# EAGLE design zeitgeist (EAGLE 9.6.2)
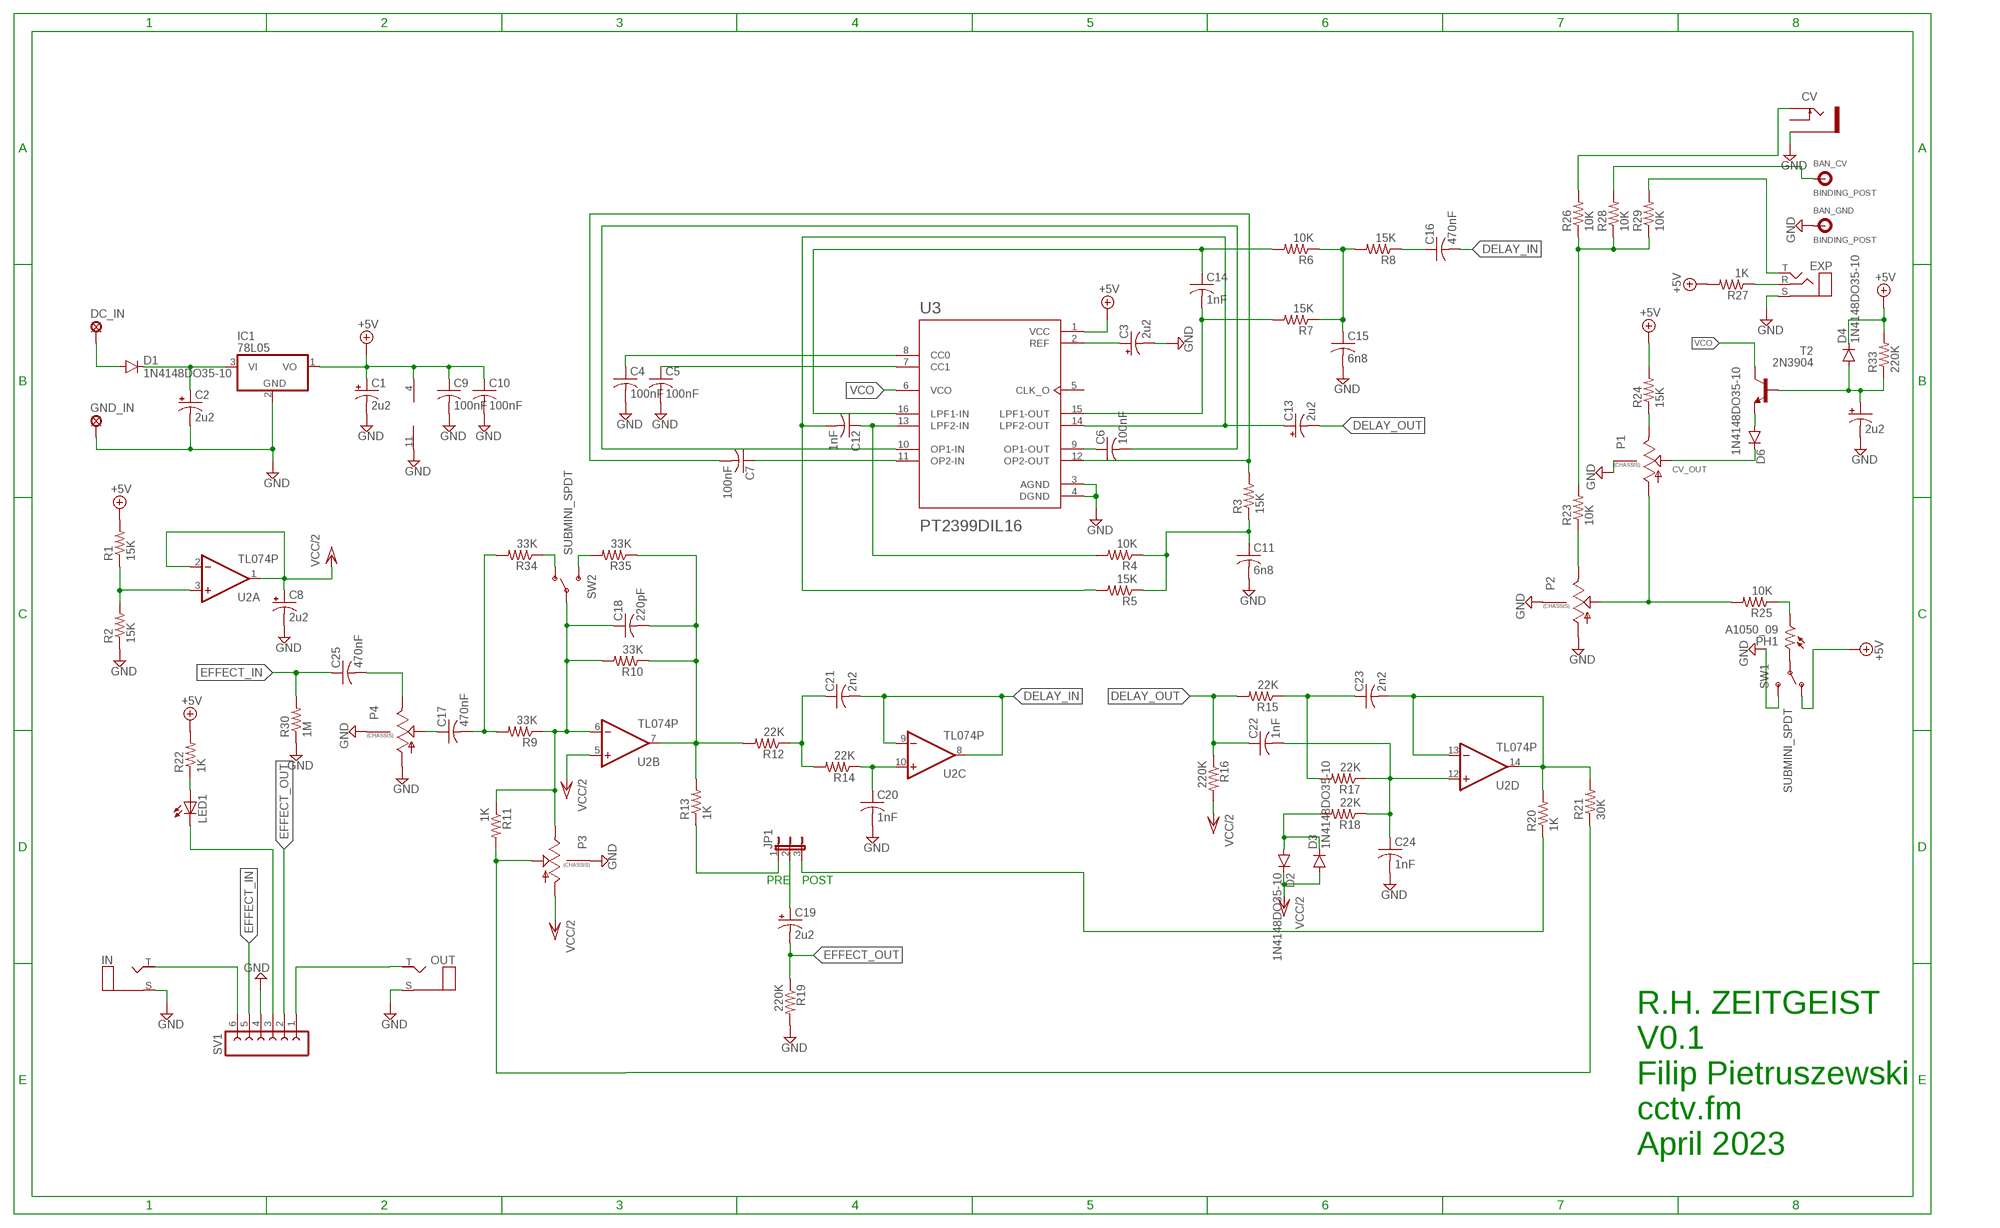
[diagram p0: schematic, sheet 1]

## Parts
BAN_CV  BINDING_POST  [BINDING_POST]
BAN_GND  BINDING_POST  [BINDING_POST]
C1  2u2  CPOL-USE2.5-6  [E2,5-6]
C2  2u2  CPOL-USE2.5-6  [E2,5-6]
C3  2u2  CPOL-USE2.5-6  [E2,5-6]
C4  100nF  C-US050-024X044  [C050-024X044]
C5  100nF  C-US050-024X044  [C050-024X044]
C6  100nF  C-US050-035X075  [C050-035X075]
C7  100nF  C-US050-035X075  [C050-035X075]
C8  2u2  CPOL-USE2.5-6  [E2,5-6]
C9  100nF  C-US050-024X044  [C050-024X044]
C10  100nF  C-US050-024X044  [C050-024X044]
C11  6n8  C-US050-035X075  [C050-035X075]
C12  1nF  C-US050-035X075  [C050-035X075]
C13  2u2  CPOL-USE2.5-6  [E2,5-6]
C14  1nF  C-US050-035X075  [C050-035X075]
C15  6n8  C-US050-035X075  [C050-035X075]
C16  470nF  C-US050-035X075  [C050-035X075]
C17  470nF  C-US050-035X075  [C050-035X075]
C18  220pF  C-US050-035X075  [C050-035X075]
C19  2u2  CPOL-USE2.5-6  [E2,5-6]
C20  1nF  C-US050-035X075  [C050-035X075]
C21  2n2  C-US050-035X075  [C050-035X075]
C22  1nF  C-US050-035X075  [C050-035X075]
C23  2n2  C-US050-035X075  [C050-035X075]
C24  1nF  C-US050-035X075  [C050-035X075]
C25  470nF  C-US050-035X075  [C050-035X075]
C26  2u2  CPOL-USE2.5-6  [E2,5-6]
CV  THONKICONNNEW  [WQP-PJ301M-12_JACK]
D1  1N4148DO35-10  [DO35-10]
D2  1N4148DO35-10  [DO35-10]
D3  1N4148DO35-10  [DO35-10]
D4  1N4148DO35-10  [DO35-10]
D6  1N4148DO35-10  [DO35-10]
DC_IN  SE14  [SE14]
EXP  STEREO_PADS  [3PADS]
GND_IN  SE14  [SE14]
IC1  78L05  78L05Z  [TO92]
IN  MONO_PADS  [2PADS]
JP1  JP2E  [JP2]
LED1  LED5MM  [LED5MM]
OUT  MONO_PADS  [2PADS]
P1  9MM_SNAP-IN_POT_CHASSIS  [9MM_SNAP-IN_POT]
P2  9MM_SNAP-IN_POT_CHASSIS  [9MM_SNAP-IN_POT]
P3  9MM_SNAP-IN_POT_CHASSIS  [9MM_SNAP-IN_POT]
P4  9MM_SNAP-IN_POT_CHASSIS  [9MM_SNAP-IN_POT]
PH1  A1050_09  [T0-46-A10XX]
R1  15K  RES-7.5-EASYSOLDER  [0204/7]
R2  15K  RES-7.5-EASYSOLDER  [0204/7]
R3  15K  RES-7.5-EASYSOLDER  [0204/7]
R4  10K  RES-7.5-EASYSOLDER  [0204/7]
R5  15K  RES-7.5-EASYSOLDER  [0204/7]
R6  10K  RES-7.5-EASYSOLDER  [0204/7]
R7  15K  RES-7.5-EASYSOLDER  [0204/7]
R8  15K  RES-7.5-EASYSOLDER  [0204/7]
R9  33K  RES-7.5-EASYSOLDER  [0204/7]
R10  33K  RES-7.5-EASYSOLDER  [0204/7]
R11  1K  RES-7.5-EASYSOLDER  [0204/7]
R12  22K  RES-7.5-EASYSOLDER  [0204/7]
R13  1K  RES-7.5-EASYSOLDER  [0204/7]
R14  22K  RES-7.5-EASYSOLDER  [0204/7]
R15  22K  RES-7.5-EASYSOLDER  [0204/7]
R16  220K  RES-7.5-EASYSOLDER  [0204/7]
R17  22K  RES-7.5-EASYSOLDER  [0204/7]
R18  22K  RES-7.5-EASYSOLDER  [0204/7]
R19  220K  RES-7.5-EASYSOLDER  [0204/7]
R20  1K  RES-7.5-EASYSOLDER  [0204/7]
R21  30K  RES-7.5-EASYSOLDER  [0204/7]
R22  1K  RES-7.5-EASYSOLDER  [0204/7]
R23  10K  RES-7.5-EASYSOLDER  [0204/7]
R24  15K  RES-7.5-EASYSOLDER  [0204/7]
R25  10K  RES-7.5-EASYSOLDER  [0204/7]
R26  10K  RES-7.5-EASYSOLDER  [0204/7]
R27  1K  RES-7.5-EASYSOLDER  [0204/7]
R28  10K  RES-7.5-EASYSOLDER  [0204/7]
R29  10K  RES-7.5-EASYSOLDER  [0204/7]
R30  1M  RES-7.5-EASYSOLDER  [0204/7]
R33  220K  RES-7.5-EASYSOLDER  [0204/7]
R34  33K  RES-7.5-EASYSOLDER  [0204/7]
R35  33K  RES-7.5-EASYSOLDER  [0204/7]
SV1  FE06-1  [FE06]
SW1  SUBMINI_SPDT  [SUBMINI_TOGGLE]
SW2  SUBMINI_SPDT  [SUBMINI_TOGGLE]
T2  2N3904  [TO92]
U2  TL074P  [DIL14]
U3  PT2399DIL16  [DIL16]

## Nets
+5V: C1.+ C9.1 C10.1 D4.C IC1.1(VO) R1.2 R22.2 R24.2 R27.2 R33.2 SW1.1(O) U2.4(P:V+) U3.1(VCC)
CV_IN: CV.P$1_TIP(TIP) R26.2
CV_OUT: D6.C P1.2(S)
DELAY_IN: C16.2 C21.2 U2.8(C:OUT) U2.9(C:-IN)
DELAY_OUT: C13.- C22.1 R15.2 R16.1
EFFECT_IN: C25.1 R30.2 SV1.5
EFFECT_OUT: C19.- R19.1 SV1.2
GND: BAN_GND.P$1 C1.- C2.- C3.- C4.2 C5.2 C8.- C9.2 C10.2 C11.2 C15.2 C20.2 C24.2 C26.- CV.P$3_SLEEVE(SLEEVE) EXP.S GND_IN.MP IC1.2(GND) IN.S OUT.S P1.CHASSIS1 P1.CHASSIS2 P2.1(A) P2.CHASSIS1 P2.CHASSIS2 P3.CHASSIS1 P3.CHASSIS2 P4.1(A) P4.CHASSIS1 P4.CHASSIS2 R2.1 R19.2 R30.1 SV1.4 SW1.3(S) U2.11(P:V-) U3.3(AGND) U3.4(DGND)
N$1: C2.+ D1.C IC1.3(VI)
N$2: C6.2 U3.10(OP1-IN)
N$3: C6.1 U3.9(OP1-OUT)
N$4: C7.1 U3.11(OP2-IN)
N$5: C3.+ U3.2(REF)
N$6: C7.2 R3.2 U3.12(OP2-OUT)
N$7: R1.1 R2.2 U2.3(A:+IN)
N$8: C5.1 U3.7(CC1)
N$9: C4.1 U3.8(CC0)
N$10: C11.1 R3.1 R4.1 R5.1
N$11: C12.1 R4.2 U3.13(LPF2-IN)
N$12: C23.1 R15.1 R17.2
N$13: C12.2 C13.+ R5.2 U3.14(LPF2-OUT)
N$14: C14.1 R6.2 U3.16(LPF1-IN)
N$15: C14.2 R7.2 U3.15(LPF1-OUT)
N$16: C15.1 R6.1 R7.1 R8.2
N$17: C16.1 R8.1
N$18: D1.A DC_IN.MP
N$19: C17.1 P4.2(S)
N$20: C18.1 P3.3(E) R9.1 R10.2 R11.1 SW2.COM(COMMON) U2.6(B:-IN)
N$21: C17.2 R9.2 R34.2
N$22: P3.2(S) R11.2 R21.1
N$23: C18.2 R10.1 R12.2 R13.2 R35.1 U2.7(B:OUT)
N$24: C19.+ JP1.2
N$25: JP1.1 R13.1
N$26: C21.1 R12.1 R14.2
N$27: C20.1 R14.1 U2.10(C:+IN)
N$28: C22.2 C24.1 R17.1 R18.1 U2.12(D:+IN)
N$29: D2.A D3.C R18.2
N$30: LED1.A R22.1
N$31: C23.2 R20.2 R21.2 U2.13(D:-IN) U2.14(D:OUT)
N$32: P2.3(E) R23.1
N$33: JP1.3 R20.1
N$34: P1.1(A) P2.2(S) R25.2
N$35: P1.3(E) R24.1
N$36: D6.A T2.3(E)
N$37: PH1.2 R25.1
N$38: PH1.1 SW1.COM(COMMON)
N$39: R23.2 R26.1 R28.1 R29.1
N$40: EXP.R R27.1
N$41: LED1.K(C) SV1.3
N$42: C25.2 P4.3(E)
N$43: IN.T SV1.6
N$44: EXP.T R29.2
N$45: BAN_CV.P$1 R28.2
N$46: OUT.T SV1.1
N$47: R35.2 SW2.3(S)
N$48: R34.1 SW2.1(O)
N$52: C26.+ D4.A R33.1 T2.2(B)
VCC/2: C8.+ D2.C D3.A P3.1(A) R16.2 U2.1(A:OUT) U2.2(A:-IN) U2.5(B:+IN)
VCO: T2.1(C) U3.6(VCO)
Unconnected: CV.P$2_SWITCH(SWITCH) U3.5(CLK_O)

## Notes on the sheet
- PRE | POST
- R.H. ZEITGEIST
  V0.1
  Filip Pietruszewski
  cctv.fm
  April 2023

## Library data of the parts
BAN_CV BAN_GND = SparkFun-Connectors:BINDING_POST: Single Banana jack. PRT-09739 (red) or PRT-09740 (blk) Footprint is a bit strange. The component itself has an threaded, insulated body that goes through the board, with a small threaded metal stud coming off the back. The intent of this package is that the post goes through a milled obling hole, and a small wire would be used to connect from the PCB pad to the metal contact on the post.
C1-C3 C8 C13 C19 C26 = rcl:CPOL-US: POLARIZED CAPACITOR, American symbol; SPICEPREFIX: C
C4-C7 C9-C12 C14-C18 C20-C25 = rcl:C-US: CAPACITOR, American symbol; SPICEPREFIX: C
CV = MusicThingModular:THONKICONN: 3.5mm socket for Eurorack modular synths
D1-D4 D6 = diode:1N4148: DIODE high speed (Philips)
DC_IN GND_IN = solpad:SE14: SOLDER PAD E1553, drill 1,4mm, distributor Buerklin, 07F820
EXP = jacks:STEREO: Stereo 1/4" TRS Jack and wiring connections Marshall style (PCB Mount): http://smallbear-electronics.mybigcommerce.com/1-4-enclosed-nmj6hcd2/ Lumberg Stereo (wired): http://smallbear-electronics.mybigcommerce.com/lumberg-1-4-compact-shrouded-stereo-jack/
IC1 = linear:78*: Positive VOLTAGE REGULATOR Source: http://cache.national.com/ds/LM/LM78L05.pdf http://www.fairchildsemi.com/ds/LM/LM7805.pdf
IN OUT = jacks:MONO: Mono 1/4" TS Jack and wiring connections Marshall style (PCB Mount): http://smallbear-electronics.mybigcommerce.com/1-4-enclosed-nmj4hcd2/ Lumberg Mono (wired): http://smallbear-electronics.mybigcommerce.com/lumberg-1-4-compact-shrouded-mono-jack/
JP1 = jumper:JP2E: JUMPER
LED1 = adafruit:LED: LED OSRAM: - CHIPLED LG R971, LG N971, LY N971, LG Q971, LY Q971, LO R971, LY R971 LH N974, LH R974 LS Q976, LO Q976, LY Q976 LO Q996 - Hyper CHIPLED LW Q18S LB Q993, LB Q99A, LB R99A - SideLED LS A670, LO A670, LY A670, LG A670, LP A670 LB A673, LV A673, LT A673, LW A673 LH A674 LY A675 LS A676, LA A676, LO A676, LY A676, LW A676 LS A679, LY A679, LG A679 - Hyper Micro SIDELED® LS Y876, LA Y876, LO Y876, LY Y876 LT Y87S - SmartLED LW L88C, LW L88S LB L89C, LB L89S, LG L890 LS L89K, LO L89K, LY L89K LS L896, LA L896, LO L896, LY L896 - TOPLED LS T670, LO T670, LY T670, LG T670, LP T670 LSG T670, LSP T670, LSY T670, LOP T670, LYG T670 LG T671, LOG T671, LSG T671 LB T673, LV T673, LT T673, LW T673 LH T674 LS T676, LA T676, LO T676, LY T676, LB T676, LH T676, LSB T676, LW T676 LB T67C, LV T67C, LT T67C, LS T67K, LO T67K, LY T67K, LW E67C LS E67B, LA E67B, LO E67B, LY E67B, LB E67C, LV E67C, LT E67C LW T67C LS T679, LY T679, LG T679 LS T770, LO T770, LY T770, LG T770, LP T770 LB T773, LV T773, LT T773, LW T773 LH T774 LS E675, LA E675, LY E675, LS T675 LS T776, LA T776, LO T776, LY T776, LB T776 LHGB T686 LT T68C, LB T68C - Hyper Mini TOPLED® LB M676 - Mini TOPLED Santana® LG M470 LS M47K, LO M47K, LY M47K Source: http://www.osram.convergy.de/
P1-P4 = MusicThingModular:9MM_SNAP-IN_POT_CHASSIS: 9mm vertical snap-in pot, Alpha / Panasonic style, with a connection to the metal chassis for grounding
PH1 = photo-elements:A10: Sensor Robust Light Sensing Applications Outdoor Light Sensing Application Source: http://optoelectronics.perkinelmer.com/content/Datasheets/DTS_PhotocellsA1050.pdf
R1-R30 R33-R35 = ptrz:RES-7.5-EASYSOLDER
SV1 = con-lsta:FE06-1: FEMALE HEADER; OC_FARNELL: unknown; OC_NEWARK: unknown
SW1 SW2 = MusicThingModular:SUBMINI_SPDT
T2 = transistor:2N3904: NPN TRANSISTOR
U2 = linear:TL074: OP AMP
U3 = PT2399:PT2399: Check availability <https://pricing.snapeda.com/parts/PT2399/Princeton/view-part?ref=eda>

## Net classes
0 default: width 0.508 mm, drill 0.508 mm, clearance 0.508 mm

## Board
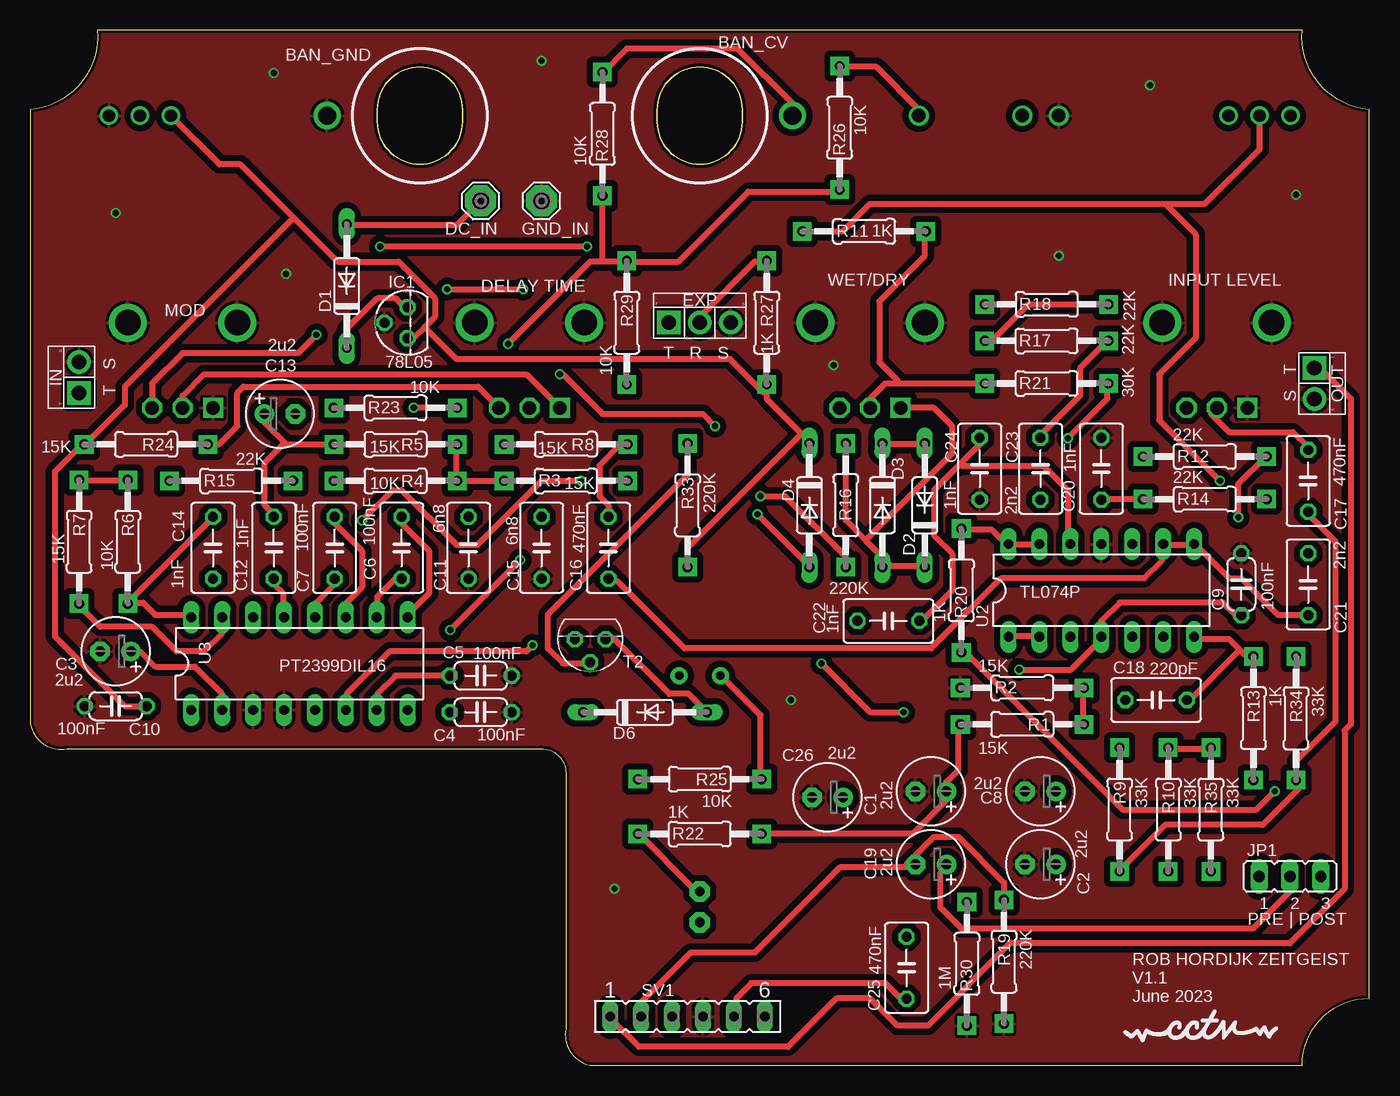
[diagram p1: board, top side]
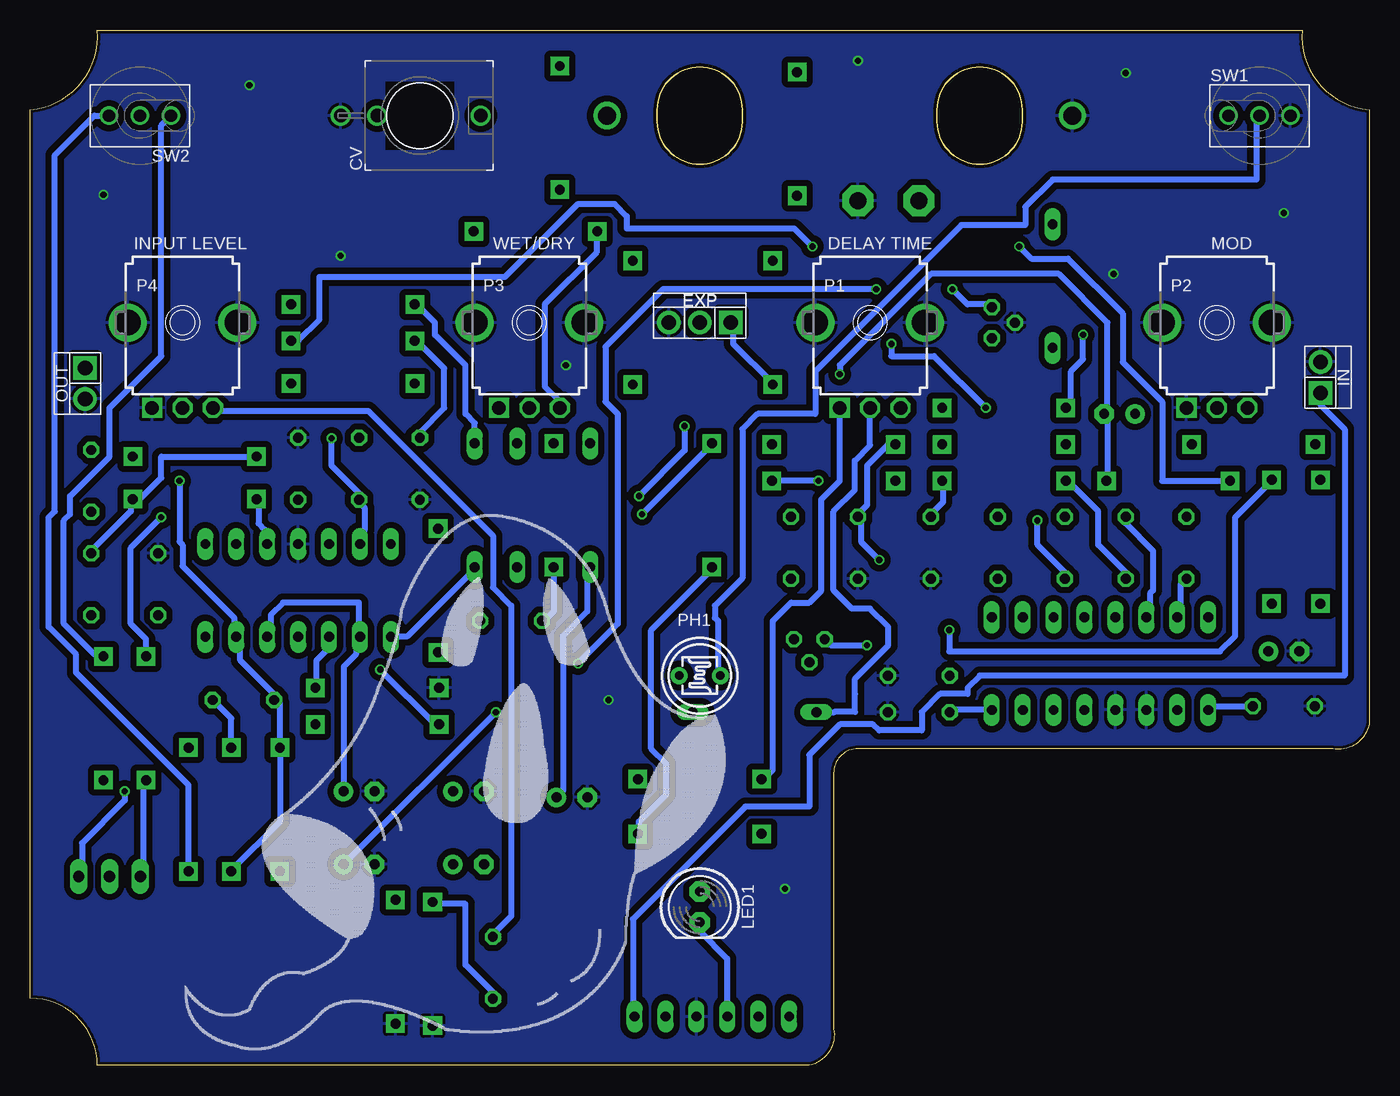
[diagram p2: board, bottom side, seen from below]

Size 110 x 85 mm. Coordinates in mm from the lower left corner, seen from the top.
Outline: 44,24 44,3 arc90 46,0 104.5,0 arc-90 110,5.5 110,78.5 arc-90 104.5,85 5.5,85 arc-90 0,78.5 0,28 arc90 3,26 42,26 arc-90 44,24
Copper layers (1*16): Top 0.035mm / dielectric 1.5mm / Bottom 0.035mm
Design rules "dirt_cheap_dirty_boards.v1": minimum track width 5mil, minimum drill 12mil, track to track 5mil, track to pad 5mil, pad to pad 5mil, via to via 5mil, smd to smd 0mil, copper to edge 10mil, drill to drill 10mil, minimum pad ring 10mil, minimum via ring 6mil, stop-mask expansion 2mil, vias tented up to drill 25mil, thermal gap 10mil

### Footprints (pad centres in the part's own frame; a part is rotated, then mirrored left to right if it is on the bottom)
BINDING_POST = drill 1.5: P$1 0,7.62
E2,5-6 = drill 0.813 pad 1.6: + -1.27,0 | drill 0.813 pad 1.6 octagon: - 1.27,0
C050-024X044 = drill 0.813 octagon: 1 -2.54,0; 2 2.54,0
C050-035X075 = drill 0.813 octagon: 1 -2.54,0; 2 2.54,0
WQP-PJ301M-12_JACK = drill 1.1: P$1_TIP 0,5; P$2_SWITCH 0,-3.5; P$3_SLEEVE 0,-6.5
DO35-10 = drill 0.813 long: A 5.08,0; C -5.08,0
SE14 = drill 1.397 pad 2.54 octagon: MP 0,0
3PADS = drill 1.2 pad 1.93: R 0,0; S 2.54,0 | drill 1.2 pad 1.93 square: T -2.54,0
TO92 = drill 0.813 octagon: 1 -1.27,0; 2 0,1.905; 3 1.27,0
2PADS = drill 1.2 pad 1.93: S 1.27,0 | drill 1.2 pad 1.93 square: T -1.27,0
JP2 = drill 0.914 long: 1 -2.54,0; 2 0,0; 3 2.54,0
LED5MM = drill 0.813 pad 1.676 octagon: A -1.27,0; K 1.27,0
9MM_SNAP-IN_POT = drill 1.1 square: 1 -2.5,-7 | drill 1.1 octagon: 2 0,-7; 3 2.5,-7 | drill 2.1 pad 2.794: CHASSIS1 -4.5,0; CHASSIS2 4.5,0
T0-46-A10XX = drill 0.7 pad 1.4: 1 -1.7,0; 2 1.7,0
0204/7 = drill 0.813 pad 1.524 square: 1 -5.08,0; 2 5.08,0
FE06 = drill 0.813 long: 1 -6.35,0; 2 -3.81,0; 3 -1.27,0; 4 1.27,0; 5 3.81,0; 6 6.35,0
SUBMINI_TOGGLE = drill 1 pad 1.422: 1 -2.54,0; 3 2.54,0; COM 0,0
TO92' = drill 0.813 octagon: 1 1.27,0; 2 0,1.905; 3 -1.27,0
DIL14 = drill 0.813 long: 1 -7.62,-3.81; 2 -5.08,-3.81; 3 -2.54,-3.81; 4 0,-3.81; 5 2.54,-3.81; 6 5.08,-3.81; 7 7.62,-3.81; 8 7.62,3.81; 9 5.08,3.81; 10 2.54,3.81; 11 0,3.81; 12 -2.54,3.81; 13 -5.08,3.81; 14 -7.62,3.81
DIL16 = drill 0.813 long: 1 -8.89,-3.81; 2 -6.35,-3.81; 3 -3.81,-3.81; 4 -1.27,-3.81; 5 1.27,-3.81; 6 3.81,-3.81; 7 6.35,-3.81; 8 8.89,-3.81; 9 8.89,3.81; 10 6.35,3.81; 11 3.81,3.81; 12 1.27,3.81; 13 -1.27,3.81; 14 -3.81,3.81; 15 -6.35,3.81; 16 -8.89,3.81

### Placement (x,y rotation side)
BAN_CV  55,78 270 top
BAN_GND  32,78 90 top
C1  74,22.5 180 top
C2  83,16.5 180 top
C3  7,34 180 top
C4  37,29 0 top
C5  37,32 0 top
C6  30.5,42.5 270 top
C7  25,42.5 270 top
C8  83,22.5 180 top
C9  99.5,39.5 90 top
C10  7,29.5 180 top
C11  36,42.5 270 top
C12  20,42.5 90 top
C13  20.5,53.5 0 top
C14  15,42.5 270 top
C15  42,42.5 270 top
C16  47.5,42.5 270 top
C17  105,48 270 top
C18  92.5,30 0 top
C19  74,16.5 180 top
C20  88,49 90 top
C21  105,39.5 270 top
C22  70.5,36.5 0 top
C23  83,49 270 top
C24  78,49 270 top
C25  72,8 90 top
C26  65.5,22 180 top
CV  78,78 270 bottom
D1  26,64 90 top
D2  73.5,46 90 top
D3  70,46 270 top
D4  64,46 270 top
D6  50.5,29 0 top
DC_IN  37,71 180 top
EXP  55,61 0 top
GND_IN  42,71 180 top
IC1  31,61 90 top
IN  4,56.5 90 top
JP1  103.5,15.5 0 top
LED1  55,13 270 bottom
OUT  105.5,56 270 top
P1  41,61 0 bottom
P2  12.5,61 0 bottom
P3  69,61 0 bottom
P4  97.5,61 0 bottom
PH1  55,32 180 bottom
R1  81.5,28 180 top
R2  81.5,31 0 top
R3  44,48 0 top
R4  30,48 180 top
R5  30,51 180 top
R6  8,43 270 top
R7  4,43 270 top
R8  44,51 180 top
R9  89.5,21 270 top
R10  93.5,21 270 top
R11  68.5,68.5 0 top
R12  96.5,50 0 top
R13  100.5,28.5 90 top
R14  96.5,46.5 0 top
R15  16.5,48 0 top
R16  67,46 90 top
R17  83.5,59.5 0 top
R18  83.5,62.5 180 top
R19  80,8.5 270 top
R20  76.5,39 90 top
R21  83.5,56 0 top
R22  55,19 0 top
R23  30,54 0 top
R24  9.5,51 180 top
R25  55,23.5 180 top
R26  66.5,77 90 top
R27  60.5,61 270 top
R28  47,76.5 90 top
R29  49,61 270 top
R30  76.95,8.33 90 top
R33  54,46 270 top
R34  104,28.5 270 top
R35  97,21 270 top
SV1  54,4 0 top
SW1  9,78 0 bottom
SW2  101,78 180 bottom
T2  2N3904  [TO92']  46,35 180 top
U2  88,39 0 top
U3  22.11,32.99 0 top

### Tracks (layer width: path | path; a pad name or v marks a point on that pad's centre or on a via)
+5V  (via drill 0.51)
  Top 0.508: 32.38,60.62 33.25,61.5 33.25,63 30.25,66 25.25,66 21.62,69.62 | 32.38,60.62 31.5,59.75 31,59.75 IC1.1 | 21.62,69.62 17.25,74 15.54,74 SW1.1 | 21.62,69.62 21.5,69.5 7.75,55.75 7.75,54.25 4.5,51 R24.2 4.25,51 2,48.75 2,35.25 7.75,29.5 9.5,29.5 C10.1 | 63.38,51.88 60.5,54.75 60.5,55.75 R27.2 60.25,55.25 57.5,58 35,58 32.5,60.5 32.38,60.62 | 63.38,51.88 64,51.25 D4.C | R33.2 54,41 54,42.5 63.25,51.75 63.38,51.88 | C9.1 99.5,37 99,37 98,38 89.5,38 88,36.5 88,35.25 U2.4 88,35 85.5,32.5 v81.25,32.5 | R22.2 60.25,19 72.5,19 75.25,21.75 75.25,22.5 C1.+ 75.25,22.75 75.25,23.25 76.25,24.25 76.25,28 R1.2
  Bottom 0.508: C10.1 9.75,29.5 13,29.5 13,29.25 U3.1 | v81.25,32.5 76.75,28 76.5,28 R1.2 | R33.2 54,40.75 59,35.75 59,26 57.75,24.75 57.75,22.25 60,20 60,19 R22.2
CV_IN
  Top 0.508: CV.P$1_TIP 73,78.5 69.5,82 66.5,82 R26.2
CV_OUT
  Bottom 0.508: D6.C 43.94,29 43.92,29.02 42.23,29.02 42.23,30.5 42.23,31.77 39.5,34.5 39.5,36 41,37.5 42.5,37.5 44,39 44,45.5 42.27,47.23 42.27,49.67 41,50.94 P1.2
DELAY_IN
  Top 0.508: C16.2 47.5,39.75 48.25,39.75 53.75,34.25 74,34.25 79.75,40 91.5,40 93,41.5 93,42.75 U2.9 93.25,42.75 95.5,42.75 U2.8 95.75,42.75 98.5,40 99.5,40 102.5,37 105,37 C21.2
DELAY_OUT  (via drill 0.51)
  Top 0.508: R16.1 67,41.75 62,46.75 v60,46.75 | v56.25,52.5 55.25,53.5 47,53.5 43.75,56.75 v43.5,56.75
  Bottom 0.508: R16.1 67,37.25 67.75,36.5 C22.1 | R15.2 21.5,48 21.5,53.25 21.75,53.5 C13.- 21.5,53.5 21.5,61 25.5,65 36,65 43.5,57.5 v43.5,56.75 | v60,46.75 56.25,50.5 v56.25,52.5
EFFECT_IN
  Top 0.508: SV1.5 58,4 58,5.5 59.25,6.75 70.25,6.75 71.5,5.5 72,5.5 C25.1
  Bottom 0.508: R30.2 76.75,13.25 74.25,13.25 74.25,8.25 72,6 72,5.5 C25.1
EFFECT_OUT
  Top 0.508: SV1.2 50.25,4 50.25,5.25 54.25,9.25 59.5,9.25 66.5,16.25 72.25,16.25 72.5,16.5 C19.- 72,16.5 74.25,18.75 76.25,18.75 80,15 80,13.75 R19.1
GND  (via drill 0.51)
  other vias: 21,65 7,70 20,81.5 42,82.5 92,80.5 104,71.5 84.5,66.5 66,57.5 62.5,30 48,14.5
  pour Top: 0,26 0,85 110,85 110,0 44,0 44,24 arc90 42,26
  pour Bottom: 0,85 110,85 110,0 44,0 44,24 arc90 42,26 0,26
N$1  (via drill 0.51)
  Top 0.508: D1.C 26,59 26,60.5 28.5,63 30,63 30.5,62.5 31,62.5 IC1.3 | v71.75,29 69,29 v65,33 | v34.25,63.75 v40.5,63.75
  Bottom 0.508: v71.75,29 84.25,16.5 C2.+ | v65,33 61.75,36.25 61.75,53.5 62.75,54.5 62.75,59 58,63.75 v40.5,63.75 | v34.25,63.75 33,62.5 31,62.5 IC1.3
N$2
  Top 0.508: U3.10 28.5,37 28.5,38.5 30,40 30.5,40 C6.2
N$3
  Top 0.508: U3.9 31,37 32.75,38.75 32.75,42.25 30.5,44.5 30.5,45 C6.1
N$4
  Top 0.508: U3.11 26,37 26,38 27.25,39.25 27.25,42.25 25,44.5 25,45 C7.1
N$5
  Top 0.508: U3.2 15.75,29.25 15.75,30.5 13.5,32.75 10.25,32.75 9,34 8.5,34 C3.+
N$6  (via drill 0.51)
  Top 0.508: U3.12 23.5,37 23.5,38 25,39.5 25,39.75 C7.2 | v45.25,48 42,48 36.75,42.75 35,42.75 30.5,47.25 29.75,47.25 v27.25,44.75
  Bottom 0.508: v45.25,48 49,48 R3.2 | v27.25,44.75 27.25,42.75 25,40.5 25,40 C7.2
N$7
  Top 0.508: R1.1 86.5,28 86.5,31 R2.2
  Bottom 0.508: U2.3 85.5,35 85.75,34.75 85.75,34 86.5,33.25 86.5,31 R2.2
N$8
  Top 0.508: U3.7 28.5,29.25 28.5,30.5 30,32 34.25,32 C5.1
N$9
  Bottom 0.508: U3.8 31,29.25 34.25,29.25 34.25,29 C4.1
N$10
  Top 0.508: R5.1 35,51 35,48 R4.1 35.25,48 38.75,48 R3.1
  Bottom 0.508: C11.1 36,45.25 35,46.25 35,48 R4.1
N$11
  Top 0.508: U3.13 20.75,37 20.75,38.75 20,39.5 20,39.75 C12.1
  Bottom 0.508: R4.2 24.75,48 22.25,45.5 22.25,42.75 20,40.5 20,40 C12.1
N$12  (via drill 0.51)
  Top 0.508: C23.1 83,51.75 86.25,55 86.25,57.25 88.5,59.5 R17.2 | v45.75,67.25 v28.75,67.25
  Bottom 0.508: v28.75,67.25 27.75,66.25 24.75,66.25 20.25,61.75 20.25,57.75 17,54.5 17,48 11.5,48 R15.1 | v45.75,67.25 47.25,68.75 61,68.75 61,69.75 62,70.75 65,70.75 71,64.75 86.25,64.75 86.25,61.25 88,59.5 88.5,59.5 R17.2
N$13
  Top 0.508: 21,51 24.75,51 R5.2 | 21,51 19.25,52.75 19.25,53.5 C13.+ | 21,51 20.75,51 19.25,49.5 19.25,46 20,45.25 C12.2
  Bottom 0.508: U3.14 18.25,37 18,37.25 18,38.75 17.75,39 17.75,42.25 20,44.5 20,45 C12.2
N$14
  Top 0.508: U3.16 13,37 10.25,37 9.25,38 8,38 R6.2 8.25,38.25 15,45 C14.1
N$15
  Top 0.508: R7.2 4,37.75 5.75,36 10,36 12,34 14.25,34 15.75,35.5 15.75,36.75 U3.15
  Bottom 0.508: U3.15 15.75,37 15.5,37.25 15.5,39.5 15,40 C14.2
N$16  (via drill 0.51)
  Top 0.508: R7.1 4,48 8,48 R6.1 | v40.25,41.5 v34.5,35.75
  Bottom 0.508: R8.2 39,51 39.5,51 41.25,49.25 41.25,46 42,45.25 C15.1 41.75,45 41.75,43 v40.25,41.5 | v34.5,35.75 34.5,34 12.25,34 11,35.25 11,45 8,48 R6.1
N$17
  Top 0.508: C16.1 47.5,45.25 47.5,46 46.75,46.75 46.75,49.25 48.5,51 49,51 R8.1
N$18
  Top 0.508: DC_IN.MP 35,69 26,69 D1.A
N$19
  Top 0.508: P4.2 97,53.5 98.5,52 103.75,52 105,50.75 C17.1
N$20  (via drill 0.51)
  Top 0.508: 93.5,70.75 69,70.75 66.75,68.5 63.5,68.5 R11.1 | 93.5,70.75 96.5,70.75 101,75.25 SW2.COM | v97.75,48 92.75,53 92.75,56.75 95.75,59.75 95.75,68.25 93.5,70.5 93.5,70.75
  Bottom 0.508: R10.2 93.5,16 89.5,20 89.5,26 R9.1 89.5,26.25 89.5,29.75 89.75,30 C18.1 90,30.25 90,30.5 92.75,33.25 92.75,34.75 93,35 U2.6 93.25,35.25 93.25,36.75 97.5,41 97.5,42.75 97.75,43 v97.75,48 | P3.3 66.5,54.5 67.75,55.75 67.75,62.5 63.5,66.75 63.5,68.5 R11.1
N$21
  Top 0.508: C17.2 105,45.25 107.25,43 107.25,28.25 104,25 104,23.5 R34.2 104.25,23.5 104.25,22.75 101.25,19.75 93.25,19.75 89.5,16 R9.2
N$22
  Top 0.508: 71.25,56 70.25,56 69,54.75 P3.2 | 71.25,56 R21.1 | R11.2 73.5,68.5 73.5,66.5 69.75,62.75 69.75,57.75 71.25,56.25 71.25,56
N$23  (via drill 0.51)
  Top 0.508: R35.1 97,26 93.5,26 R10.1 | 99.38,34.12 99.75,33.75 100.5,33.75 R13.2 | 99.38,34.12 98.5,35 95.75,35 U2.7 | v99.25,45 99.25,47.75 101.5,50 R12.2 | C18.2 95.25,30 99.25,34 99.38,34.12
  Bottom 0.508: C18.2 95,30 93.5,28.5 93.5,26.25 R10.1 | v99.25,45 101.75,42.5 101.75,36.25 100.5,35 100.5,33.75 R13.2
N$24
  Top 0.508: JP1.2 103.5,14.25 100.5,11.25 76.5,11.25 74.75,13 74.75,15.75 75.5,16.5 C19.+
N$25
  Bottom 0.508: JP1.1 100.75,15.5 100.75,23 100.5,23.25 R13.1
N$26
  Bottom 0.508: C21.1 105,42.25 101.75,45.5 101.75,46.5 R14.2 101.5,46 99.25,48.25 99.25,50 91.5,50 R12.1
N$27
  Top 0.508: C20.1 88,46.5 91.25,46.5 R14.1
  Bottom 0.508: U2.10 90.75,43 90.75,44 91.25,44.5 91.25,46.5 R14.1
N$28
  Top 0.508: 76.38,49.38 78,51 78,51.5 C24.1 | 76.38,49.38 74.25,47.25 74.25,43.5 75.75,42 75.75,39 73.25,36.5 C22.2 | U2.12 85.25,43 85.25,47.25 83.25,49.25 76.5,49.25 76.38,49.38 | R18.1 88.5,62.5 82,62.5 79,59.5 78.5,59.5 R17.1
  Bottom 0.508: R17.1 78.25,59.5 76,57.25 76,54 78,52 78,51.75 C24.1
N$29
  Top 0.508: D3.C 70,51 73.5,51 D2.A
  Bottom 0.508: R18.2 78.25,62.5 76.75,61 76.75,60 74.25,57.5 74.25,53.5 73.5,52.75 73.5,51.25 D2.A
N$30
  Top 0.508: R22.1 50,19 54.5,14.5 55,14.5 LED1.A
N$31  (via drill 0.51)
  Top 0.508: U2.13 82.75,42.75 80.5,42.75 U2.14 80.25,42.75 79,44 76.5,44 R20.2 | v85.25,51.5 88.5,54.75 88.5,56 R21.2
  Bottom 0.508: U2.13 82.75,43 82.75,43.75 82.5,44 82.5,45.75 83,46.25 C23.2 83,46.5 83,47 85.25,49.25 v85.25,51.5
N$32  (via drill 0.51)
  Top 0.508: v23.5,60 22,58.5 12.5,58.5 10,56 P2.3
  Bottom 0.508: R23.1 24.5,54.42 24.5,57 23.5,58 v23.5,60
N$33  (via drill 0.51)
  Top 0.508: v102.25,22.5 100.75,21 89.75,21 77,33.75 76.5,33.75 R20.1
  Bottom 0.508: v102.25,22.5 102.25,21.75 105.75,18.25 105.75,15.75 106,15.5 JP1.3
N$34
  Top 0.508: P1.1 40.75,56.75 14.25,56.75 12.5,55 P2.2
  Bottom 0.508: R25.2 49.75,23.5 49,24.25 49,36.5 47.5,38 46,38 45.02,38.98 45.02,46.48 43.5,48 P1.1
N$35
  Top 0.508: R24.1 15.5,51 17,52.5 17,55.23 17.5,55.73 36.77,55.73 P1.3
N$36
  Top 0.508: T2.3 48,35 52.5,30.5 54.08,30.5 D6.A
N$37
  Top 0.508: PH1.2 56.75,32 60,28.75 60,23.5 R25.1
N$38
  Bottom 0.508: SW1.COM 9.25,78 9.25,72.75 26,72.75 28.25,70.5 28.25,69 33.5,69 45.5,57 45.5,53.5 50.25,53.5 51.5,52.25 51.5,40 53.75,37.75 53.75,36.75 53.5,36.5 53.5,32 PH1.1
N$39  (via drill 0.51)
  Top 0.508: v39.25,59.25 46,66 47,66 | 47,66 49,66 R29.1 49.25,66 53.25,66 59,71.75 66.5,71.75 R26.1 | R28.1 47,71.25 47,66.25 47,66 | R23.2 v31.5,54
  Bottom 0.508: v31.5,54 35.75,58.25 39.25,58.25 v39.25,59.25
N$40
  Top 0.508: EXP.R 55,61.5 59.5,66 60.5,66 R27.1
N$41
  Bottom 0.508: SV1.3 52.75,4 52.75,8.75 55,11 55,11.5 LED1.K
N$42
  Bottom 0.508: P4.3 95,53.75 82.25,53.75 72,43.5 72,39.25 70.5,37.75 70.5,12.25 72,10.75 C25.2
N$43
  Bottom 0.508: SV1.6 60.5,4 60.5,12 51.25,21.25 46,21.25 46,25.5 43.5,28 40.75,28 40.25,27.5 36.75,27.5 36.75,29 35.25,30.5 33,30.5 33,31 32,32 2,32 2,52.25 4,54.25 4,55 IN.T
N$44
  Bottom 0.508: R29.2 49,56 52.25,59.25 52.25,61 EXP.T
N$45
  Top 0.508: BAN_CV.P$1 62.62,79 58.12,83.5 49,83.5 47,81.5 R28.2
N$46
  Top 0.508: SV1.1 47.75,4 47.75,3.75 50,1.5 62.25,1.5 66.25,5.5 69,5.5 71.25,3.25 73.75,3.25 80.5,10 103.5,10 108,14.5 108,27.5 108.5,28 108.5,54.75 106,57.25 105.5,57.25 OUT.T
N$47
  Bottom 0.508: R35.2 97,16 97,23 106.25,32.25 106.25,33.75 108.5,36 108.5,45 108,45.5 108,74.75 104.75,78 SW2.3
N$48
  Bottom 0.508: R34.1 104,33.75 104.75,33.75 107.25,36.25 107.25,44.75 106.75,45.25 106.75,46.75 103.5,50 103.5,54 99.25,58.25 99.25,77.21 SW2.1
N$52  (via drill 0.51)
  Top 0.508: T2.2 46,33 43.75,33 42.5,34.25 42.5,37 54,48.5 54,51 R33.1 | v59.75,45.25 64,41 D4.A
  Bottom 0.508: v59.75,45.25 54,51 R33.1 | C26.+ 66.75,22 66.25,22.5 66.25,35.25 64.25,37.25 64.25,40.5 64,40.75 D4.A
VCC/2
  Top 0.508: D2.C 73.5,41 70,41 D3.A 70.5,41.25 68.62,43.12 | 68.62,43.12 67,44.75 67,51 R16.2 | P3.1 74.25,54 75.75,52.5 75.75,50.25 68.75,43.25 68.62,43.12 | U2.1 80.5,35.25 82.75,35.25 U2.2
  Bottom 0.508: U2.5 90.5,35.25 90.25,35.5 90.25,37 89.25,38 83,38 83,35.25 U2.2 83.25,35.25 83.25,33.75 84.25,32.75 84.25,22.5 C8.+ | D2.C 73.5,40.75 79,35.25 80.25,35.25 U2.1
VCO  (via drill 0.51)
  Top 0.508: v41.25,34.5 40.75,34 29.5,34 26,30.5 26,29.25 U3.6
  Bottom 0.508: v41.25,34.5 44.25,34.5 44.5,34.75 44.5,35 T2.1

### Text on the board
tNames: DELAY TIME | WET/DRY | INPUT LEVEL | MOD | T R S | T S | S T | PRE | POST | ROB HORDIJK ZEITGEIST / V1.1 / June 2023
bNames: MOD | DELAY TIME | WET/DRY | INPUT LEVEL
tDocu: 1590BB2